# Altium schematic sheet Peredat4ik.SchDoc
size A4
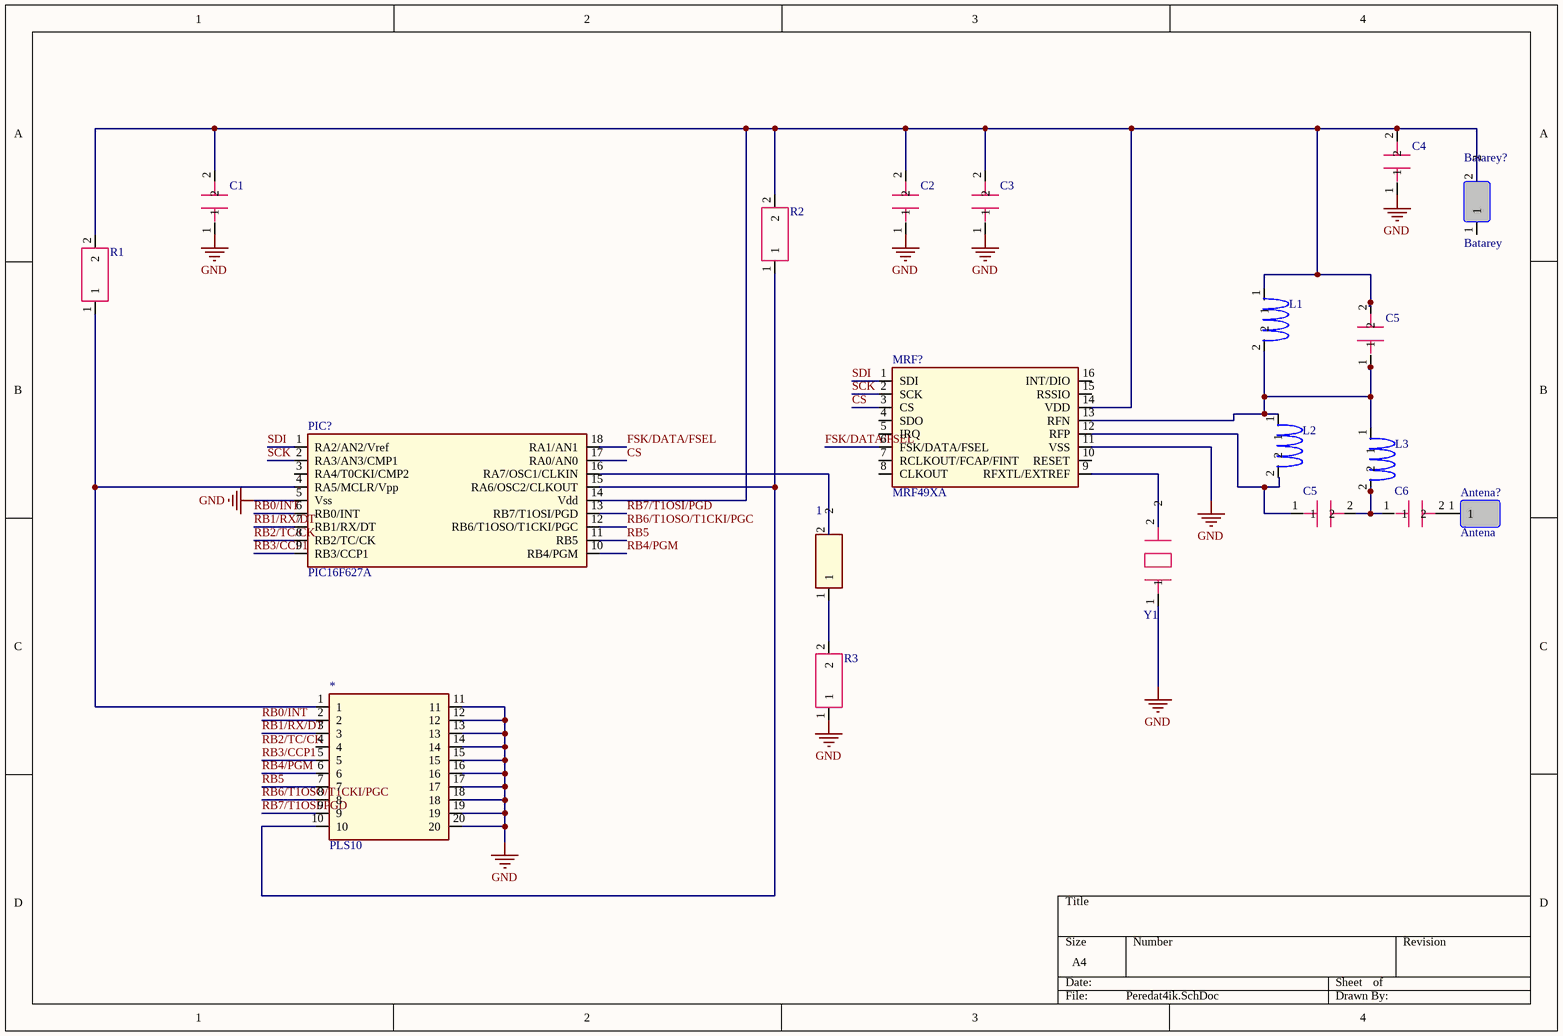
[diagram p0: Peredat4ik.SchDoc]

## Parts
(Parts that share a designator on the sheet are numbered #1, #2 ... from top to bottom, then left to right.)
1  (no value)  [Light-emitting diode]
*  PLS10  [PLS10]
?  Y1  [Quartz]
Antena?  Antena  [Anteny]
Batarey?  Batarey  [Batarey]
C1  (no value)  [С0805]
C2  (no value)  [С0805]
C3  (no value)  [С0805]
C4  (no value)  [С0805]
C5#1  (no value)  [С0805]
C5#2  (no value)  [С0805]
C6  (no value)  [С0805]
L1  (no value)  [L?]
L2  (no value)  [L?]
L3  (no value)  [L?]
MRF?  MRF49XA  [MRF49XA]
PIC?  PIC16F627A  [PIC16F627A]
R1  (no value)  [R0805]
R2  (no value)  [R0805]
R3  (no value)  [R0805]

## Nets
GND: *.11 *.12 *.13 *.14 *.15 *.16 *.17 *.18 *.19 *.20 ?.1 C1.1 C2.1 C3.1 C4.1 MRF?.11(VSS) PIC?.5(Vss) R3.1
CS: MRF?.3(CS) PIC?.17(RA0/AN0)
FSK/DATA/FSEL: MRF?.6(FSK/DATA/FSEL) PIC?.18(RA1/AN1)
RB0/INT: *.2 PIC?.6(RB0/INT)
RB1/RX/DT: *.3 PIC?.7(RB1/RX/DT)
RB2/TC/CK: PIC?.8(RB2/TC/CK)
RB3/CCP1: *.5 PIC?.9(RB3/CCP1)
RB4/PGM: *.6 PIC?.10(RB4/PGM)
RB5: *.7 PIC?.11(RB5)
RB6/T1OSO/T1CKI/PGC: *.8 PIC?.12(RB6/T1OSO/T1CKI/PGC)
RB7/T1OSI/PGD: *.9 PIC?.13(RB7/T1OSI/PGD)
SCK: MRF?.2(SCK) PIC?.2(RA3/AN3/CMP1)
SDI: MRF?.1(SDI) PIC?.1(RA2/AN2/Vref)
Net1_1: 1.1 R3.2
Net1_2: 1.2 PIC?.16(RA7/OSC1/CLKIN)
Net*_1: *.1 PIC?.4(RA5/MCLR/Vpp) R1.1
Net*_10: *.10 PIC?.15(RA6/OSC2/CLKOUT) R2.1
Net?_2: ?.2 MRF?.9(RFXTL/EXTREF)
NetAntena?_1: Antena?.1 C6.2
NetBatarey?_2: Batarey?.2 C1.2 C2.2 C3.2 C4.2 C5#1.2 L1.1 MRF?.14(VDD) PIC?.14(Vdd) R1.2 R2.2
NetC5#1_1: C5#1.1 L1.2 L2.1 L3.1 MRF?.13(RFN)
NetC5#2_1: C5#2.1 L2.2 MRF?.12(RFP)
NetC5#2_2: C5#2.2 C6.1 L3.2

Not connected (* = marked no-connect by the designer): * 4; Batarey? 1; MRF? 4(SDO) 5(IRQ) 7(RCLKOUT/FCAP/FINT) 8(CLKOUT) 10(RESET) 15(RSSIO) 16(INT/DIO); PIC? 3(RA4/T0CKI/CMP2)

## Notes on the sheet
- Labels drawn without touching a wire or pin: RB2/TC/CK

## Library data of the parts
1 = Light-emitting diode
? = Quartz
C1-C4 C5#1 C5#2 C6 = Capacity
L1-L3 = Inductance
R1-R3 = Rezistor